# EAGLE design TXB0104_breakout (EAGLE 6.4)
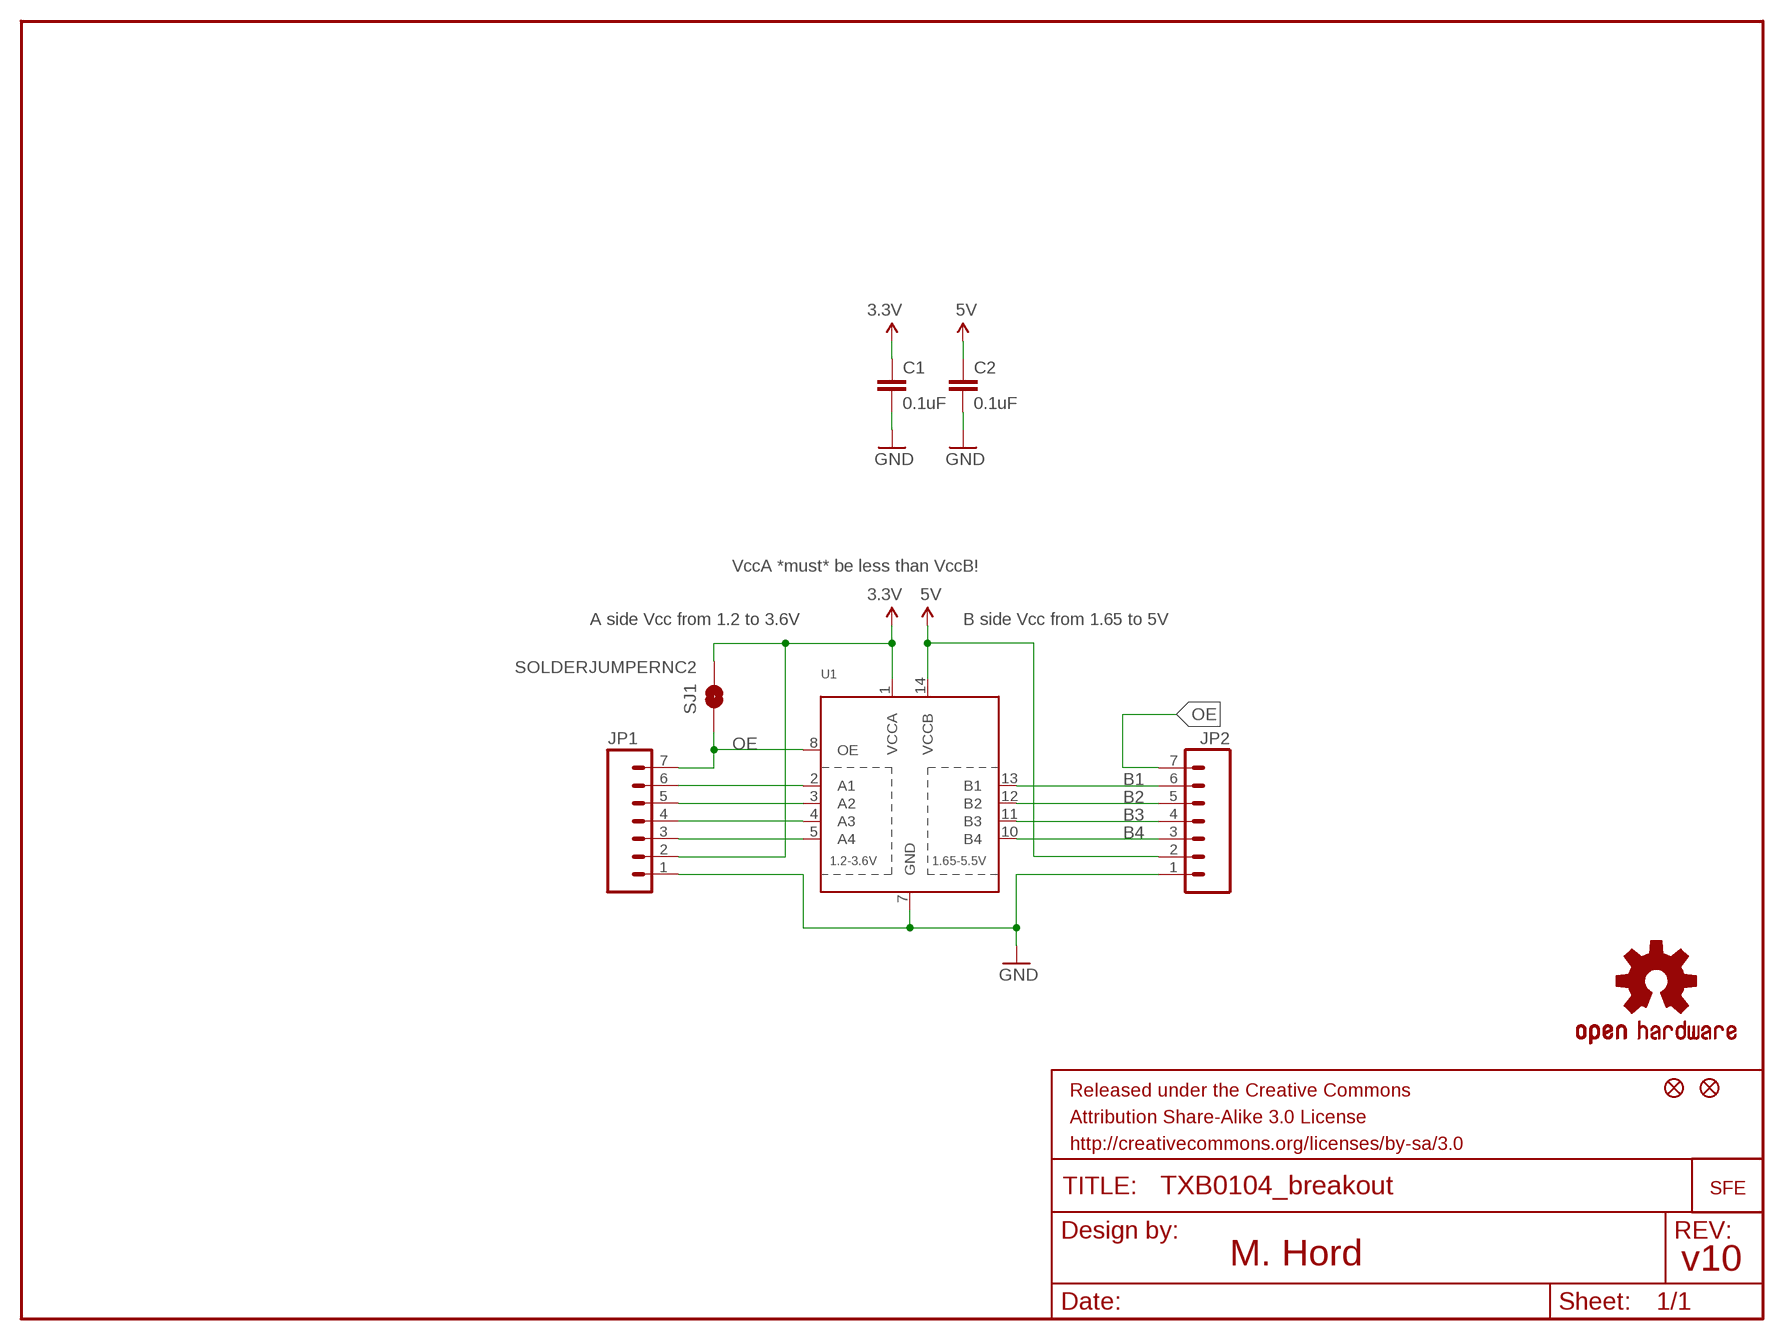
[diagram p0: schematic, sheet 1]

## Parts
C1  0.1uF  0.1UF-25V(+80/-20%)(0603)  [0603-CAP]
C2  0.1uF  0.1UF-25V(+80/-20%)(0603)  [0603-CAP]
FID1  FIDUCIALUFIDUCIAL  [MICRO-FIDUCIAL]
FID2  FIDUCIALUFIDUCIAL  [MICRO-FIDUCIAL]
FRAME1  FRAME-LETTER  [CREATIVE_COMMONS]
JP1  M07  [1X07]
JP2  M07  [1X07]
LOGO1  LOGO-SFESK  [SFE-LOGO-FLAME]
LOGO2  OSHW-LOGOS  [OSHW-LOGO-S]
SJ1  SOLDERJUMPERNC2  [SJ_2S-NOTRACE]
U1  TXB0104PWRSOIC14  [SO14]

## Nets
3.3V: C1.1 JP1.2 SJ1.2 U1.1(VCCA)
5V: C2.1 JP2.2 U1.14(VCCB)
B1: JP2.6 U1.13(B1)
B2: JP2.5 U1.12(B2)
B3: JP2.4 U1.11(B3)
B4: JP2.3 U1.10(B4)
GND: C1.2 C2.2 JP1.1 JP2.1 U1.7(GND)
N$1: JP1.3 U1.5(A4)
N$2: JP1.4 U1.4(A3)
N$3: JP1.5 U1.3(A2)
N$4: JP1.6 U1.2(A1)
OE: JP1.7 JP2.7 SJ1.1 U1.8(OE)

## Notes on the sheet
- VccA *must* be less than VccB!
- A side Vcc from 1.2 to 3.6V | B side Vcc from 1.65 to 5V
- M. Hord | v10

## Library data of the parts
C1 C2 = SparkFun-Capacitors:0.1UF-25V(+80/-20%)(0603): Ceramic Standard decoupling cap CAP-00810; PROD_ID: CAP-00810
FID1 FID2 = SparkFun-Aesthetics:FIDUCIAL: Fiducial Alignment Points Various fiducial points for machine vision alignment.
FRAME1 = SparkFun-Aesthetics:FRAME-LETTER: Schematic Frame Standard 8.5x11 US Letter frame
JP1 JP2 = SparkFun-Connectors:M07: Header 7 Standard 7-pin 0.1" header. Use with straight break away headers (SKU : PRT-00116), right angle break away headers (PRT-00553), swiss pins (PRT-00743), machine pins (PRT-00117), and female headers (PRT-00115). NOTES ON THE VARIANTS LOCK and LOCK_LONGPADS... This footprint was designed to help hold the alignment of a through-hole component (i.e. 7-pin header) while soldering it into place. You may notice that each hole has been shifted either up or down by 0.005 of an inch from it's more standard position (which is usually a perfectly straight line). This slight alteration caused the pins (the squares in the middle) to touch the edges of the holes. Because they are alternating, it causes a "brace" to hold the header in place. 0.005 has proven to be the perfect amount of "off-center" position when using our standard breakaway headers. Although looks a little odd when you look at the bare footprint, once you have a header in there, the alteration is very hard to notice. Also, if you push a header all the way into place, it is covered up entirely on the bottom side. This idea of altering the position of holes to aid alignment will be further integrated into the Sparkfun Library for other footprints. It can help hold any component with 3 or more connection pins.
LOGO1 = SparkFun-Aesthetics:LOGO-SFE: Spark Fun Electronics PCB Logo This is the standard Spark Fun Electronics PCB logo.
LOGO2 = SparkFun-Aesthetics:OSHW-LOGO: Open Source Hardware Logo This logo indicates the piece of hardware it is found on incorporates a OSHW license and/or adheres to the definition of open source hardware found here: http://freedomdefined.org/OSHW
SJ1 = SparkFun-Passives:SOLDERJUMPER: Solder Jumper Standard SMD solder jumper. Used to automate production. Two varients : Normally Open and Normally Closed are the same, but have different paste layers. NC will have a large amount of paste and should jumper during reflow.
U1 = SparkFun-DigitalIC:TXB0104PWR: 4-Bit Bi-Directional Level Shifter 1.2V-3.6V (VCCA) to 1.65V-5.5V (VCCB) bi-directional level shifter with auto direction sensing. Max data rate - VCCA 1.8V: 20Mbps (50ns), VCCA 3.3V: 100Mbps (10ns) Digikey: 296-21929-1-ND (TSSOP) IC-11329; PROD_ID: IC-11329

## Board
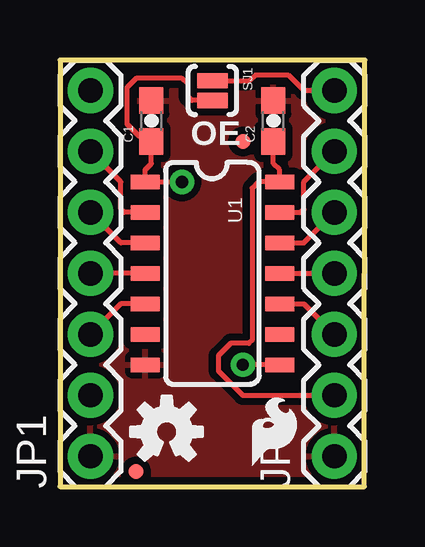
[diagram p1: board, top side]
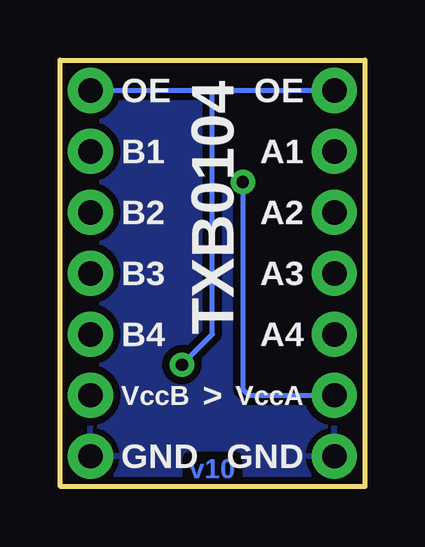
[diagram p2: board, bottom side, seen from below]

Size 12.7 x 17.78 mm. Coordinates in mm from the lower left corner, seen from the top.
Outline: 0,0 12.68,0 12.7,17.78 0,17.78 0,0
Copper layers (1*16): Top 0.035mm / dielectric 1.5mm / Bottom 0.035mm
Design rules "Sparkfun": minimum track width 8mil, minimum drill 20mil, track to track 8mil, track to pad 8mil, pad to pad 8mil, via to via 8mil, smd to smd 8mil, copper to edge 8mil, drill to drill 8mil, minimum pad ring 12mil, minimum via ring 10mil, stop-mask expansion 4mil, vias tented up to drill 20mil, thermal gap 10mil

### Footprints (pad centres in the part's own frame; a part is rotated, then mirrored left to right if it is on the bottom)
0603-CAP = smd 1.1 x 1: 1 -0.85,0; 2 0.85,0
MICRO-FIDUCIAL = smd 0.635 x 0.635: 1 0,0
1X07 = drill 1.016 pad 1.88: 1 0,0; 2 2.54,0; 3 5.08,0; 4 7.62,0; 5 10.16,0; 6 12.7,0; 7 15.24,0
SJ_2S-NOTRACE = smd 0.635 x 1.27: 1 -0.401,0; 2 0.413,0
SO14 = smd 0.6 x 1.2: 1 -3.81,-2.8; 2 -2.54,-2.8; 3 -1.27,-2.8; 4 0,-2.8; 5 1.27,-2.8; 6 2.54,-2.8; 7 3.81,-2.8; 8 3.81,2.8; 9 2.54,2.8; 10 1.27,2.8; 11 0,2.8; 12 -1.27,2.8; 13 -2.54,2.8; 14 -3.81,2.8

### Placement (x,y rotation side)
C1  3.81,15.24 90 top
C2  8.89,15.24 90 top
FID1  7.62,14.38 0 top
FID2  3.17,0.64 0 top
FRAME1  -77.47,1.27 0 top  (outside the outline)
JP1  1.27,1.27 90 top
JP2  11.43,1.27 90 top
LOGO1  8,0.89 0 top
LOGO2  4.45,2.29 0 top
SJ1  6.35,16.51 270 top
U1  6.35,8.89 270 top

### Tracks (layer width: path | path; a pad name or v marks a point on that pad's centre or on a via)
3.3V  (via drill 0.51)
  Top 0.203: SJ1.2 5.49,16.1 5.33,16.26 5.33,16.76 5.08,17.02 3.17,17.02 2.79,16.64 2.79,15.11 3.32,14.59 C1.1 3.81,13.46 3.55,13.2 U1.1 v5.08,12.7
  Top 0.254: C1.1 3.81,13.97
  Bottom 0.203: v5.08,12.7 5.08,4.06 4.83,3.81 JP1.2
5V
  Top 0.203: JP2.2 7.62,3.81 6.6,4.83 6.6,5.46 7.11,5.97 7.87,5.97 8,6.1 8,12.45 8.26,12.7 U1.14 9.15,13.2 8.89,13.46 C2.1
  Top 0.254: C2.1 8.89,13.97
B1
  Top 0.203: U1.13 10.03,11.43 10.16,11.56 10.16,12.7 JP2.6
B2
  Top 0.203: U1.12 10.16,10.16 JP2.5
B3
  Top 0.203: U1.11 JP2.4
B4
  Top 0.203: U1.10 10.16,7.62 JP2.3
GND
  pour Bottom (isolate 0.305): 0,17.78 12.7,17.78 12.7,0 0,0
  pour Top (isolate 0.305): 0,17.78 12.7,17.78 12.7,0 0,0
N$1
  Top 0.203: U1.5 2.54,7.62 JP1.3
N$2
  Top 0.203: U1.4 JP1.4
N$3
  Top 0.203: U1.3 2.54,10.16 JP1.5
N$4
  Top 0.203: U1.2 2.67,11.43 2.54,11.56 2.54,12.7 JP1.6
OE  (via drill 0.51)
  Top 0.203: U1.8 v7.62,5.08 | JP2.7 10.16,16.51 9.51,17.16 8.15,17.16 7.89,16.91 SJ1.1
  Bottom 0.203: v7.62,5.08 6.35,6.35 6.35,16.51 | 6.35,16.51 JP1.7 | JP2.7 6.35,16.51

### Text on the board
Bottom: v10
tPlace: OE
bPlace: OE | OE | A1 | B1 | A2 | B2 | A3 | B3 | A4 | TXB0104 | B4 | VccA | > | VccB | GND | GND
tNames: M. Hord